# Altium schematic sheet GPS.SchDoc: GPS module
size A4
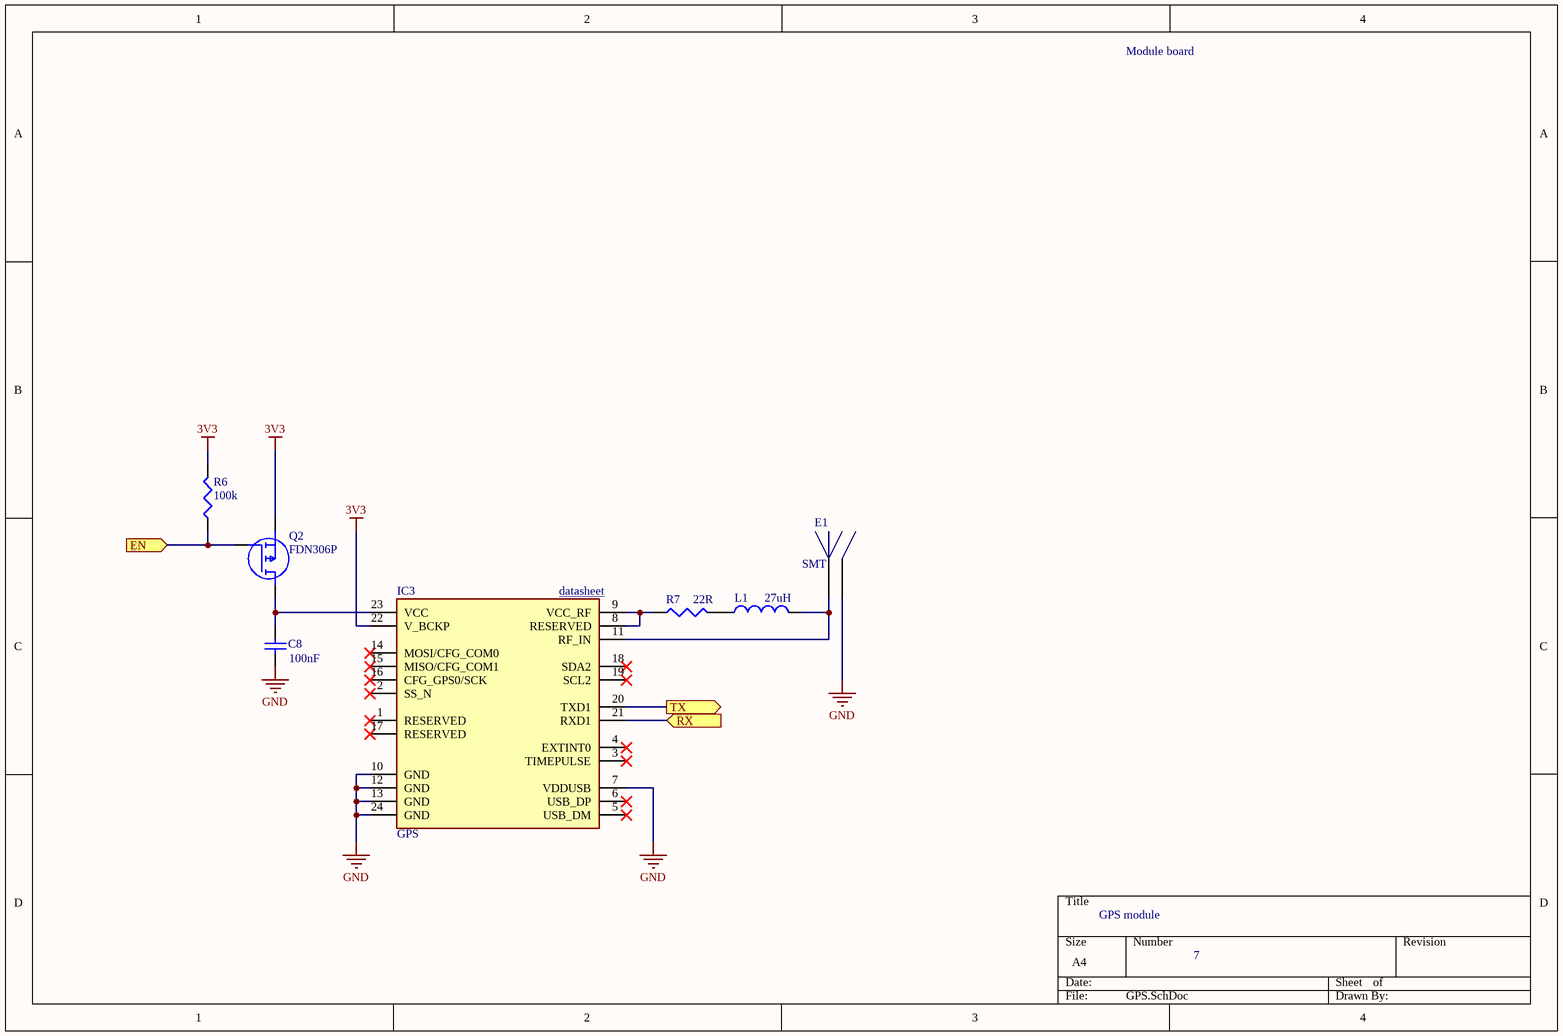
[diagram p0: GPS.SchDoc]

## Parts
C8  value 100nF  [C0805]  (hidden comment: Cap)
E1  SMT  [UFLRSMT160]
IC3  GPS  [NEO6M0001_only_used_pins]
L1  value 27uH  [L-0805]  (hidden comment: Inductor)
Q2  FDN306P  [SOT95P237X112-3N]
R6  value 100k  [R0603]  (hidden comment: Res3)
R7  value 22R  [R0603]

## Ports
EN (in), RX (in), TX (out)

## Nets
3V3: IC3.22(V_BCKP) Q2.2(S) R6.2
GND: C8.1 E1.2(GND) IC3.7(VDDUSB) IC3.10(GND) IC3.12(GND) IC3.13(GND) IC3.24(GND)
EN: Q2.1(G) R6.1 ; port EN
RX: IC3.21(RXD1) ; port RX
TX: IC3.20(TXD1) ; port TX
NetC8_2: C8.2 IC3.23(VCC) Q2.3(D)
NetE1_1: E1.1(SIG) IC3.11(RF_IN) L1.2
NetIC3_8: IC3.8(RESERVED) IC3.9(VCC_RF) R7.1
NetL1_1: L1.1 R7.2

Not connected (* = marked no-connect by the designer): IC3 1(RESERVED)* 2(SS_N)* 3(TIMEPULSE)* 4(EXTINT0)* 5(USB_DM)* 6(USB_DP)* 14(MOSI/CFG_COM0)* 15(MISO/CFG_COM1)* 16(CFG_GPS0/SCK)* 17(RESERVED)* 18(SDA2)* 19(SCL2)*

## Notes on the sheet
- Module board
- (near IC3) datasheet <https://download.kamami.pl/p563067-NEO-6_DataSheet_%28GPS.G6-HW-09005%29.pdf>
- 7

## Library data of the parts
C8 = Cap: Capacitor; Published: 8-Jun-2000; LatestRevisionDate: 17-Jul-2002; LatestRevisionNote: Re-released for DXP Platform.; PackageReference: RAD-0.3; Publisher: Altium Limited; PackageDescription: Radial Cap, Thru-Hole; 2 Leads; 0.3 in Pin Spacing
E1 = SMT_antenne
IC3 = NEO-6M-0-001: GPS modle; Manufacturer_Name: U-Blox; Datasheet Link: https://www.u-blox.com/sites/default/files/products/documents/NEO-6_DataSheet_%28GPS.G6-HW-09005%29.pdf; Height: 2.6mm; Manufacturer_Part_Number: NEO-6M-0-001; Arrow Part Number: NEO-6M-0-001
L1 = Inductor: Code_IEC: 1005; Published: 8-Jun-2000; LatestRevisionDate: 29-May-2009; LatestRevisionNote: IPC-7351 Footprint Added.; PackageReference: 0402-A; Publisher: Altium Limited; PackageDescription: Chip Inductor; Code_JEITA: 0402
Q2 = FDN306P: MOSFET (P-Channel); Manufacturer_Name: ON Semiconductor; Datasheet Link: http://uk.rs-online.com/web/p/products/1241702; Height: 1.12mm; Manufacturer_Part_Number: FDN306P; Arrow Part Number: FDN306P; Arrow Price/Stock: https://www.arrow.com/en/products/fdn306p/on-semiconductor; Mouser Part Number: 512-FDN306P; Mouser Price/Stock: https://www.mouser.co.uk/ProductDetail/ON-Semiconductor-Fairchild/FDN306P?qs=GeD7q9OHBPy9Kkc110idSQ%3D%3D
R6 R7 = Res3: Resistor; Published: 8-Jun-2000; LatestRevisionDate: 29-May-2009; LatestRevisionNote: IPC-7351 Footprint Added.; PackageReference: J1-0603; Publisher: Altium Limited; PackageDescription: Chip Resistor